# Altium schematic sheet Misc.SchDoc: Miscellaneous Peripherals (Button, LED, GPIO, etc.)
size A4; DocumentNumber: 16; SheetNumber: 16; SheetTotal: 16
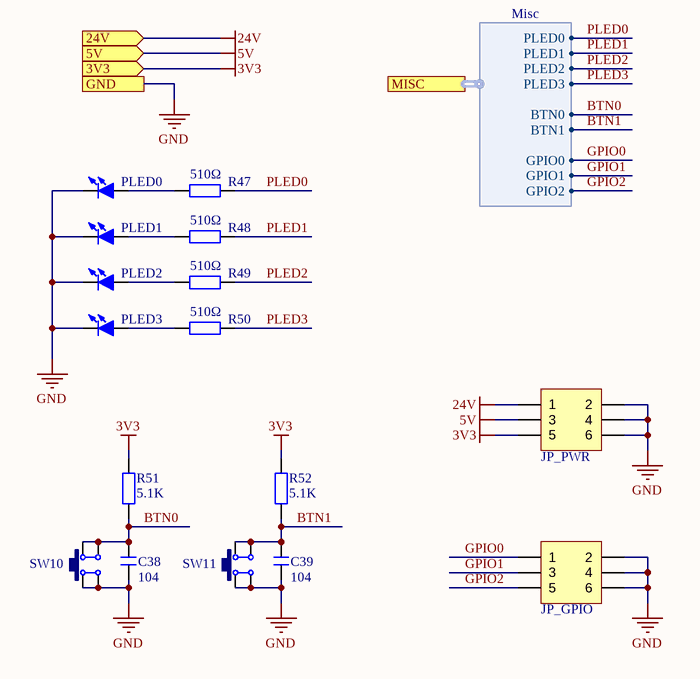
[diagram p0: Misc.SchDoc]

## Parts
C38  104  [C 0603_L]
C39  104  [C 0603_L]
JP_GPIO  Header3X2  [HDR2.54-LI-2x3P]  (value not drawn)
JP_PWR  Header3X2  [HDR2.54-LI-2x3P]  (value not drawn)
PLED0  Green  [LED 0603G]  (value not drawn)
PLED1  Green  [LED 0603G]  (value not drawn)
PLED2  Green  [LED 0603G]  (value not drawn)
PLED3  Green  [LED 0603G]  (value not drawn)
R47  510Ω  [R 0603_L]
R48  510Ω  [R 0603_L]
R49  510Ω  [R 0603_L]
R50  510Ω  [R 0603_L]
R51  5.1K  [R 0603_L]
R52  5.1K  [R 0603_L]
SW10  6x6x5  [TSW SMD-6*6*4.3]  (value not drawn)
SW11  6x6x5  [TSW SMD-6*6*4.3]  (value not drawn)

## Ports
3V3 (in), 5V (in), 24V (in), GND, MISC (harness Misc)

## Harnesses
Misc: PLED0, PLED1, PLED2, PLED3, BTN1, BTN0, GPIO0, GPIO1, GPIO2

## Nets
3V3: JP_PWR.5 R51.2 R52.2 ; port 3V3
5V: JP_PWR.3 ; port 5V
24V: JP_PWR.1 ; port 24V
GND: C38.1 C39.1 JP_GPIO.2 JP_GPIO.4 JP_GPIO.6 JP_PWR.2 JP_PWR.4 JP_PWR.6 PLED0.2(K) PLED1.2(K) PLED2.2(K) PLED3.2(K) SW10.1 SW10.4 SW11.1 SW11.4 ; port GND
BTN0: C38.2 R51.1 SW10.2 SW10.3 ; port MISC.BTN0
BTN1: C39.2 R52.1 SW11.2 SW11.3 ; port MISC.BTN1
GPIO0: JP_GPIO.1 ; port MISC.GPIO0
GPIO1: JP_GPIO.3 ; port MISC.GPIO1
GPIO2: JP_GPIO.5 ; port MISC.GPIO2
PLED0: R47.2 ; port MISC.PLED0
PLED1: R48.2 ; port MISC.PLED1
PLED2: R49.2 ; port MISC.PLED2
PLED3: R50.2 ; port MISC.PLED3
NetPLED0_1: PLED0.1(A) R47.1
NetPLED1_1: PLED1.1(A) R48.1
NetPLED2_1: PLED2.1(A) R49.1
NetPLED3_1: PLED3.1(A) R50.1

## Notes on the sheet
- Title
- FileName:
- Version:
- Date:
- Project
- Designed By:
- Descriptions:
- Sheet:
- of

## Library data of the parts
C38 C39 = C: 贴片电容; BOM名称: 无极性贴片电容; 淘宝ID: 封装库来自淘宝 ID：黄晶宝石; 联系售后，技术支持: https://shop463601444.taobao.com; 唯一出售店铺网址: https://shop463601444.taobao.com
JP_GPIO JP_PWR = Header 3X2: 3*2P接插件; 版权归属: 封装库来自淘宝 ID：黄晶宝石; BOM名称: 3*2P接插件; 学习资源: https://shop463601444.taobao.com
PLED0-PLED3 = LED-SMD: 贴片LED; 版权归属: 封装库来自淘宝 ID：黄晶宝石; BOM名称: 贴片LED; 学习资源: https://shop463601444.taobao.com
R47-R52 = R: 贴片电阻; 版权归属: 来自淘宝 ID：黄晶宝石; 封装库来自淘宝卖家 ID：黄晶宝石: 其他店铺购入均为盗版，不享受售后技术支持服务，请立即申请退款; BOM名称: 贴片电阻; 联系售后: https://shop463601444.taobao.com
SW10 SW11 = TSW SMD-6x6: 贴片6x6轻触开关 / C3010208; 版权归属: 封装库来自淘宝 ID：黄晶宝石; BOM名称: 贴片6x6轻触开关; 唯一出售店铺网址: https://shop463601444.taobao.com